# Altium schematic sheet Gain.SchDoc
size A4
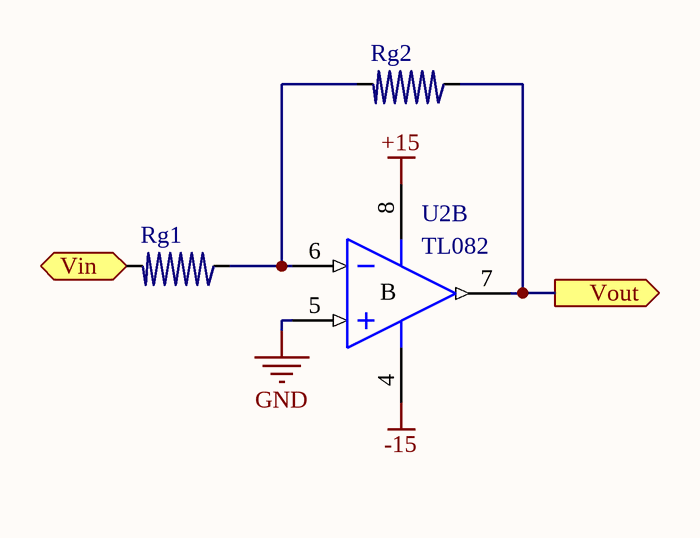
[diagram p0: Gain.SchDoc]

## Parts
Rg1  (no value)  [PCBComponent_1]
Rg2  (no value)  [PCBComponent_1]
U2  TL082  [DIP8]  (part B of 2)

## Ports
Vin (in), Vout (out)

## Nets
+15: U2.8(V+)
-15: U2.4(V-)
GND: U2.5(IN+)
Vin: Rg1.1 ; port Vin
Vout: Rg2.2 U2.7(OUT) ; port Vout
NetRg1_2: Rg1.2 Rg2.1 U2.6(IN-)

## Notes on the sheet
- (in symbol TL082AMN, part B) B

## Library data of the parts
Rg1 Rg2 = SPres
U2 = TL082AMN: General-Purpose J-FET Dual Operational Amplifier; Published: 24-Aug-2001; LatestRevisionDate: 06-Jun-2005; LatestRevisionNote: Stylized 3D Model Added.; DatasheetVersion: Jan-1999; PackageReference: DIP8; Publisher: Altium Limited; PackageDescription: DIP; 8 Leads; Row Spacing 7.62 mm; Pitch 2.54 mm; Code_JEDEC: MO-001-AN; ComponentLink1Description: Manufacturer Link; ComponentLink1URL: http://www.st.com/; ComponentLink2Description: Datasheet; ComponentLink2URL: http://www.st.com/stonline/products/literature/ds/2300/tl082.pdf